# Altium schematic sheet ZX-XH2.54-4PLT1_ZX-XH2.54-4PLT.schdoc
size 124 x 99 mm
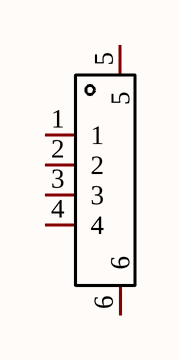
[diagram p0: ZX-XH2.54-4PLT1_ZX-XH2.54-4PLT.schdoc]

## Parts
U?  ZX-XH2.54-4PLT  [CONN-SMD_4P-P2.54_C9900012758]  (value not drawn)

## Nets

Not connected (* = marked no-connect by the designer): U? 1 2 3 4 5 6

## Library data of the parts
U? = ZX-XH2.54-4PLT: Manufacturer: Megastar(兆星); Add into BOM: yes; Pins Structure: 1x4P; Pitch: 2.54mm; Reference Series: XH; Number of PINs Per Row: 4; Current Rating (Max): 3A; Symbol: ZX-XH2.54-4PLT; Device: ZX-XH2.54-4PLT; LCSC Part Name: ZX-XH2.54-4PLT; Supplier Part: C7429682; Manufacturer Part: ZX-XH2.54-4PLT; Supplier Footprint: SMD,P=2.54mm; JLCPCB Part Class: Extended Part; Datasheet: https://atta.szlcsc.com/upload/public/pdf/source/20230619/0839CF43A4681B40F50854985C226EB8.pdf; Supplier: LCSC; Convert to PCB: yes; Mounting Style: 立贴; Number of Pins: 4P; Number of Rows: 1; Row Spacing: -; Contact Material: 黄铜; Contact Plating: 锡; Operating Temperature Range: -25℃~+85℃